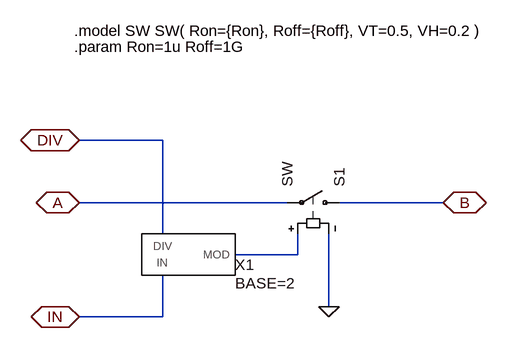
[diagram p0: schematic DivModSwitch.asc]
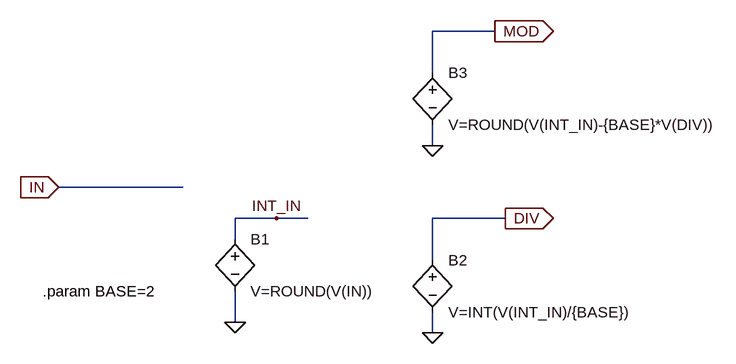
[diagram p1: sub-circuit divmod.asc]
DivModSwitch.asc, the LTspice schematic file:
Version 4
SHEET 1 988 680
WIRE -80 -96 -208 -96
WIRE 112 0 -208 0
WIRE 352 0 192 0
WIRE -80 48 -80 -96
WIRE 128 80 128 48
WIRE 128 80 32 80
WIRE 176 160 176 48
WIRE -80 176 -80 112
WIRE -80 176 -208 176
FLAG 176 160 0
FLAG -208 0 A
IOPIN -208 0 BiDir
FLAG 352 0 B
IOPIN 352 0 BiDir
FLAG -208 176 IN
IOPIN -208 176 BiDir
FLAG -208 -96 DIV
IOPIN -208 -96 BiDir
SYMBOL DivMod -32 80 M180
WINDOW 39 64 -44 Left 2
SYMATTR SpiceLine BASE=2
SYMATTR InstName X1
SYMBOL sw 208 0 M270
SYMATTR InstName S1
TEXT -216 -264 Left 2 !.model SW SW( Ron={Ron}, Roff={Roff}, VT=0.5, VH=0.2 )
TEXT -216 -240 Left 2 !.param Ron=1u Roff=1G

divmod.asc, the sub-circuit schematic file:
Version 4
SHEET 1 2360 1444
WIRE 944 -80 848 -80
WIRE 848 -16 848 -80
WIRE 848 96 848 64
WIRE 464 160 272 160
WIRE 608 208 544 208
WIRE 656 208 608 208
WIRE 960 208 848 208
WIRE 544 240 544 208
WIRE 848 272 848 208
WIRE 544 368 544 320
WIRE 848 384 848 352
FLAG 960 208 DIV
IOPIN 960 208 Out
FLAG 272 160 IN
IOPIN 272 160 In
FLAG 944 -80 MOD
IOPIN 944 -80 Out
FLAG 544 368 0
FLAG 608 208 INT_IN
FLAG 848 384 0
FLAG 848 96 0
SYMBOL bv 544 224 R0
SYMATTR InstName B1
SYMATTR Value V=ROUND(V(IN))
SYMBOL bv 848 256 R0
SYMATTR InstName B2
SYMATTR Value V=INT(V(INT_IN)/{BASE})
SYMBOL bv 848 -32 R0
SYMATTR InstName B3
SYMATTR Value V=ROUND(V(INT_IN)-{BASE}*V(DIV))
TEXT 248 320 Left 2 !.param BASE=2

The netlist it stands for:
* DivModSwitch.asc
XX1 IN DIV N001 divmod params: BASE=2
S1 B A N001 0 SW

* block symbol definitions
.subckt divmod IN DIV MOD
B1 INT_IN 0 V=ROUND(V(IN))
B2 DIV 0 V=INT(V(INT_IN)/{BASE})
B3 MOD 0 V=ROUND(V(INT_IN)-{BASE}*V(DIV))
.param BASE=2
.ends divmod

.model SW SW( Ron={Ron}, Roff={Roff}, VT=0.5, VH=0.2 )
.param Ron=1u Roff=1G
.backanno
.end